# EasyEDA Pro project NUEVO board Rev. B.epro, board StepperDrive
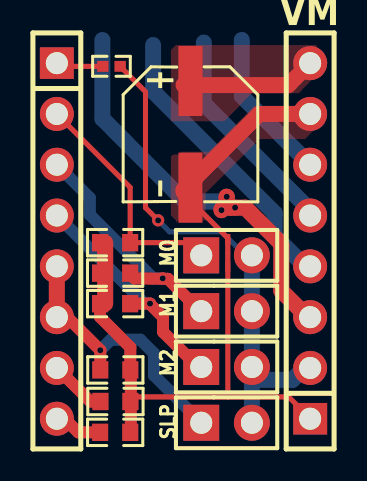
[diagram p10: board, top side]
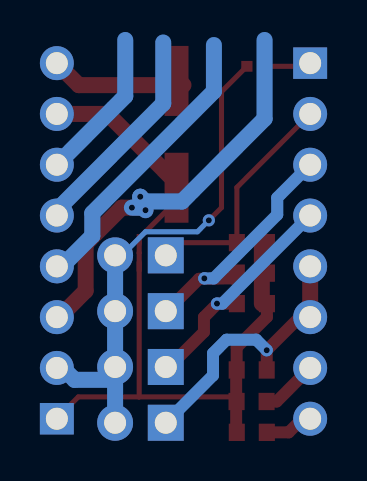
[diagram p11: board, bottom side, seen from below]

No outline. copper layers: Top Layer, Bottom Layer. Coordinates in mm from the lowest, leftmost part position.
Stack: Top Layer 0.035mm / Dielectric1 1.51mm FR4 er 4.5 / Bottom Layer 0.035mm

## Design rules (mm)
template: JLCPCB Capability(Two Layers Board)
spacing copperThickness1oz (default): track to track 0.102, other pairs 0.152 to 0.3
spacing copperThickness2oz: track to track 0.203, other pairs 0.152 to 0.3
track width copperThickness1oz (default): min 0.127, default 0.254, max 2.54
track width copperThickness2oz: min 0.203, default 0.254, max 2.54
differential pair differentialPair (default): width min 0.127, default 0.254, max 2.54; gap min 0.152, default 0.152
via viaSize (default): diameter min 0.5, default 0.61, max 10; hole min 0.3, default 0.305, max 6.3

## Placement (name value [footprint] x y rotation side)
C11  47uF  [CAP-SMD_BD6.3-L6.6-W6.6-FD]  6.7 14.9 270 top
M0  HX PZ2.54-1x2P ZZ  [HDR-TH_2P-P2.54-V-M-3]  8.51 8.85 0 top
M1  HX PZ2.54-1x2P ZZ  [HDR-TH_2P-P2.54-V-M-3]  8.51 6.06 0 top
M2  HX PZ2.54-1x2P ZZ  [HDR-TH_2P-P2.54-V-M-3]  8.51 3.27 0 top
R3  100kΩ  [R0603]  2.92 6.44 180 top
R4  100kΩ  [R0603]  2.92 7.96 180 top
R5  100kΩ  [R0603]  2.92 9.48 180 top
R6  10kΩ  [R0402]  2.74 18.3 180 top
R7  100kΩ  [R0603]  2.93 3.12 0 top
R8  100kΩ  [R0603]  2.94 1.54 0 top
R9  100kΩ  [R0603]  2.92 0 0 top
SLP  HX PZ2.54-1x2P ZZ  [HDR-TH_2P-P2.54-V-M-3]  8.51 0.48 0 top
U1  PM2.54-1X8PM-H85  [HDR-TH_8P-P2.54-V-F]  0 9.57 270 top
U2  PM2.54-1X8PM-H85  [HDR-TH_8P-P2.54-V-F]  12.7 9.57 90 top
U7  -  [short connect]  8.57 8.53 90 top

## Footprints (pads in the part's own frame, mm; a bottom-side part is the same pattern mirrored in y, then rotated)
CAP-SMD_BD6.3-L6.6-W6.6-FD
  rect 3.5x1.2 smd: 1(-2.67,0) 2(2.67,0)
HDR-TH_2P-P2.54-V-M-3
  rect 1.8x1.8 hole 1.1: 1(-1.27,0)
  round 1.8 hole 1.1: 2(1.27,0)
HDR-TH_8P-P2.54-V-F
  rect 1.575x1.7 hole 1.1: 1(-8.89,0)
  round 1.7 hole 1.1: 2(-6.35,0) 3(-3.81,0) 4(-1.27,0) 5(1.27,0) 6(3.81,0) 7(6.35,0) 8(8.89,0)
R0402
  rect 0.566x0.54 smd: 1(-0.433,0) 2(0.433,0)
R0603
  rect 0.806x0.864 smd: 1(-0.753,0) 2(0.753,0)
short connect
  rect 1x0.256 smd: 1(0,0) 2(0.889,0)

## Nets
GND: R3.2 R4.2 R5.2 R7.2 R8.2 R9.2 U2.1 U7.1
GND_M: C11.2 U2.7 U7.2
VCC: M0.2 M1.2 M2.2 R6.1 SLP.2 U2.2
A1: U2.4
A2: U2.3
B1: U2.5
B2: U2.6
DIR: R9.1 U1.8
EN: R6.2 U1.1
STEP: R8.1 U1.7
VM: C11.1 U2.8
$1N667: M1.1 R4.1 U1.3
$1N670: M0.1 R5.1 U1.2
$1N676: M2.1 R3.1 U1.4
$1N1196: R7.1 SLP.1 U1.5 U1.6

## Via types
v1: diameter 0.61, hole 0.305, Top Layer to Bottom Layer, 7 vias

## Routing (per net, layer and track width the routed paths; a pad name or vN(x,y) marks a point on that pad's centre or on a via; arc(x,y) is an arc through that point)
GND: length 26.6
  Top Layer w0.254: U7.1 8.57,1.78 8.58,1.77 ; 3.71,0 R9.2 ; 8.58,1.77 3.72,1.77 ; 8.58,1.77 11.63,1.77 12.9,0.5
  Top Layer w0.6: R7.2 3.68,4.25 2.17,5.77 R3.2 ; 3.71,0 3.71,3.1
  Top Layer w0.8: 2.42,9.48 2.42,6.44
GND_M: length 11.6
  Top Layer w0.254: U7.2 8.57,9.71 6.7,11.59 C11.2
  Top Layer w0.8: 6.35,12.02 6.35,12.12 10.15,15.92 U2.7
VCC: length 24.8
  Top Layer w0.254: v1(5.08,10.6) 4.44,11.24 4.44,17.03 R6.1
  Bottom Layer w0.254: M0.2 9.43,8.85 8.25,10.03 5.65,10.03 v1(5.08,10.6)
  Bottom Layer w0.8: 9.78,2.63 SLP.2 ; 9.78,2.63 M2.2 M1.2 9.78,8.22 ; 9.78,2.63 11.81,2.63 12.41,3.22 U2.2
A1: length 14.5
  Bottom Layer w0.8: 4.83,19.36 4.83,17.05 10.92,10.96 10.92,9.83 12.45,8.3 U2.4
A2: length 22
  Top Layer w0.8: v1(8.52,11.78) 8.51,11.77 8.51,11.41 ; 8.51,11.41 8.25,11.16 v1(8.25,11.11) ; 8.51,11.41 8.68,11.24 v1(8.94,11.24) 9.45,11.24 11.23,9.45 11.23,9.4 11.26,9.38 11.26,7.08 12.57,5.76 U2.3
  Bottom Layer w0.8: v1(8.94,11.24) 8.38,11.24 ; 8.38,11.24 8.52,11.37 v1(8.52,11.78) 8.28,11.54 6.42,11.54 2.29,15.68 2.29,19.62 ; 8.38,11.24 v1(8.25,11.11)
B1: length 10.9
  Bottom Layer w0.8: 7.37,19.49 7.37,16.44 12.7,11.11 U2.5
B2: length 7.7
  Bottom Layer w0.8: 9.27,19.62 9.27,16.81 U2.6
DIR: length 2.5
  Top Layer w0.6: R9.1 1.08,0 0.4,0.68 U1.8
EN: length 2.4
  Top Layer w0.254: U1.1 0.16,18.3 R6.2
STEP: length 2.9
  Top Layer w0.6: U1.7 1.68,1.54 R8.1
VM: length 6.8
  Top Layer w0.8: 6.35,17.36 11.6,17.36 U2.8
$1N667: length 12.4
  Top Layer w0.6: 3.76,7.83 3.89,7.7 5.57,7.68 7.22,6.02
  Bottom Layer w0.6: v1(5.31,7.7) 4.83,7.7 1.65,10.88 1.65,11.73 U1.3
$1N670: length 11.8
  Top Layer w0.254: 7.24,8.85 6.6,9.48 R5.1 3.67,12.25 U1.2
$1N676: length 11.5
  Top Layer w0.6: 4.69,6.39 5.32,5.76 5.32,5.02 7.17,3.17 ; 3.93,6.44 4.67,6.44
  Bottom Layer w0.6: v1(4.67,6.44) 4.4,6.44 U1.4
$1N1196: length 14
  Top Layer w0.6: U1.6 0.52,5.76 v1(2.18,4.11) R7.1
  Top Layer w0.8: U1.5 U1.6
  Bottom Layer w0.6: 7.24,0.48 4.87,2.85 4.87,3.95 4.19,4.63 2.7,4.63 v1(2.18,4.11)

## Copper pours and planes (outline as drawn; the poured copper is in the pictures)
GND_M on Top Layer: 5.72,16.32 13.46,16.32 13.46,10.47 5.72,10.47
VM on Top Layer: 5.72,19.36 13.59,19.36 13.59,15.55 5.72,15.55

## Text on the board
Top Silkscreen Layer: VM
